# Altium schematic sheet Guitar Amp_1.SchDoc
size 243 x 149 mm
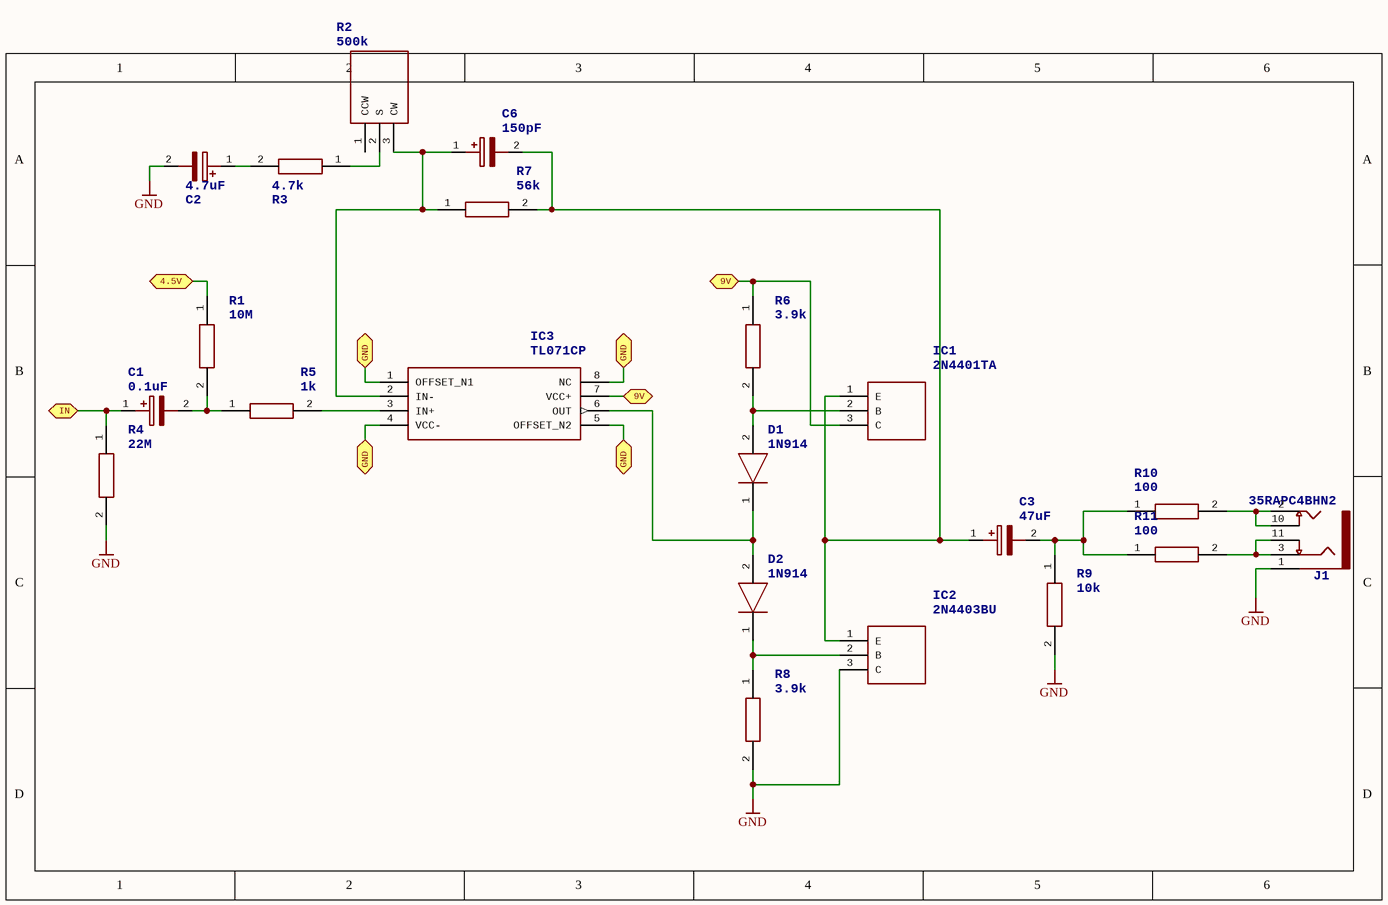
[diagram p0: Guitar Amp_1.SchDoc]

## Parts
C1  0.1uF  [CAPPRD200W55D500H1200]
C2  4.7uF  [CAPPRD200W55D500H1200]
C3  47uF  [CAPPRD200W55D500H1200]
C6  150pF  [CAPPRD200W55D500H1200]
D1  1N914  [DIO_1N914]
D2  1N914  [DIO_1N914]
IC1  2N4401TA  [KA431AZTA]
IC2  2N4403BU  [KA431AZTA]
IC3  TL071CP  [DIP794W53P254L959H508Q8N]
J1  35RAPC4BHN2  [SWITCHCRAFT_35RAPC4BHN2]
R1  10M  [RESAD1630W60L710D230]
R2  500k  [P160KN0QD15B1MEG]
R3  4.7k  [RESAD1630W60L710D230]
R4  22M  [RESAD1630W60L710D230]
R5  1k  [RESAD1630W60L710D230]
R6  3.9k  [RESAD1630W60L710D230]
R7  56k  [RESAD1630W60L710D230]
R8  3.9k  [RESAD1630W60L710D230]
R9  10k  [RESAD1630W60L710D230]
R10  100  [RESAD1630W60L710D230]
R11  100  [RESAD1630W60L710D230]

## Ports
4.5V, 9V, GND, IN

## Nets
GND: C2.2(-) IC2.3(C) J1.1 R4.2 R8.2 R9.2
4.5V: R1.1 ; port 4.5V
9V: IC1.3(C) IC3.7(VCC+) R6.1 ; port 9V
GND: IC3.1(OFFSET_N1) IC3.4(VCC-) IC3.5(OFFSET_N2) IC3.8(NC) ; port GND  [a separate net that carries the same name]
IN: C1.1(+) R4.1 ; port IN
NetC1_2: C1.2(-) R1.2 R5.1
NetC2_1: C2.1(+) R3.2
NetC3_1: C3.1(+) C6.2(-) IC1.1(E) IC2.1(E) R7.2
NetC3_2: C3.2(-) R9.1 R10.1 R11.1
NetC6_1: C6.1(+) IC3.2(IN-) R2.3(CW) R7.1
NetD1_1: D1.1(K) D2.2(A) IC3.6(OUT)
NetD1_2: D1.2(A) IC1.2(B) R6.2
NetD2_1: D2.1(K) IC2.2(B) R8.1
NetIC3_3: IC3.3(IN+) R5.2
NetJ1_2: J1.2 J1.10 R10.2
NetJ1_3: J1.3 J1.11 R11.2
NetR2_2: R2.2(S) R3.1

Not connected (* = marked no-connect by the designer): R2 1(CCW)

## Library data of the parts
C1-C3 C6 = ECA-1CM470: Panasonic Aluminium Electrolytic Capacitor 47uF 16V dc 5mm M Series Aluminium, Through Hole Electrolytic, +/-20%   Source:  Datasheet
D1 D2 = 1N914: Small Signal Diode   Source:  Datasheet
IC1 = 2N4401TA: NPN General Purpose Amplifier   Source:  Datasheet
IC2 = 2N4403BU: PNP General Purpose Amplifier   Source:  Datasheet
IC3 = TL071CP: Low-Noise JFET-Input General-Purpose Operational Amplifier   Source:  Datasheet
J1 = 35RAPC4BHN2: Conn 3.5MM Stereo Jack F 5 POS Solder RA Thru-Hole 5 Terminal 1 Port
R1 R3-R11 = MF1_4LCT52R103J: Metal Film Resistors - Through Hole 1/4 WATT 10K OHM 5%   Source:  Datasheet
R2 = P160KN-0QC15A500K: Potentiometers 16mm Rotary Panel Potentiometer   Source:  Datasheet